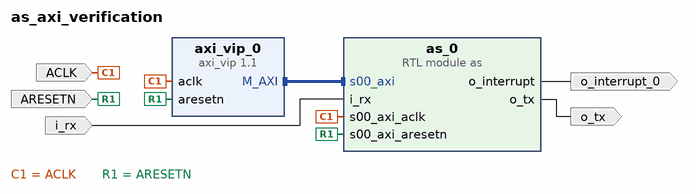
[diagram p0: block diagram of the top level]
# Vivado block design as_axi_verification, xc7a100tcsg324-1, Vivado 2023.2
create_bd_design as_axi_verification

create_bd_port -dir I -type rst ARESETN
create_bd_port -dir I -type clk ACLK
set_property -dict {CONFIG.FREQ_HZ 100000000} [get_bd_ports ACLK]
create_bd_port -dir O -type intr o_interrupt_0
create_bd_port -dir O o_tx
create_bd_port -dir I i_rx

create_bd_cell -type ip -vlnv xilinx.com:ip:axi_vip:1.1 axi_vip_0
set_property -dict [list \
  CONFIG.ADDR_WIDTH 32 \
  CONFIG.DATA_WIDTH 32 \
  CONFIG.HAS_BRESP 1 \
  CONFIG.HAS_PROT 1 \
  CONFIG.HAS_RRESP 1 \
  CONFIG.HAS_WSTRB 1 \
  CONFIG.INTERFACE_MODE MASTER \
  CONFIG.PROTOCOL AXI4LITE \
  CONFIG.READ_WRITE_MODE READ_WRITE \
] [get_bd_cells axi_vip_0]
create_bd_cell -type module -reference as as_0
set_property -dict [list \
  CONFIG.C_AS_CONTROL_CALIBRATION_TIME 2 \
  CONFIG.C_AS_CONTROL_FIRST_READING_TIME 35 \
  CONFIG.C_AS_CONTROL_MS_DIVISOR 100 \
  CONFIG.C_AS_CONTROL_POWER_UP_TIME 3 \
  CONFIG.C_AS_CONTROL_RANGE_READING_TIME 34 \
  CONFIG.C_AS_UART_BAUDRATE_DIVISOR 4 \
] [get_bd_cells as_0]

# ---- connections ----

connect_bd_intf_net [get_bd_intf_pins axi_vip_0/M_AXI] [get_bd_intf_pins as_0/s00_axi]
connect_bd_net [get_bd_ports ACLK] [get_bd_pins axi_vip_0/aclk] [get_bd_pins as_0/s00_axi_aclk]
connect_bd_net [get_bd_ports ARESETN] [get_bd_pins axi_vip_0/aresetn] [get_bd_pins as_0/s00_axi_aresetn]
connect_bd_net [get_bd_pins as_0/o_interrupt] [get_bd_ports o_interrupt_0]
connect_bd_net [get_bd_pins as_0/o_tx] [get_bd_ports o_tx]
connect_bd_net [get_bd_ports i_rx] [get_bd_pins as_0/i_rx]

# ---- address map ----
assign_bd_address -offset 0x00000000 -range 4K -target_address_space [get_bd_addr_spaces axi_vip_0/Master_AXI] [get_bd_addr_segs as_0/s00_axi/reg0]

validate_bd_design
save_bd_design
